# Altium project PCB_Project1.PrjPCB
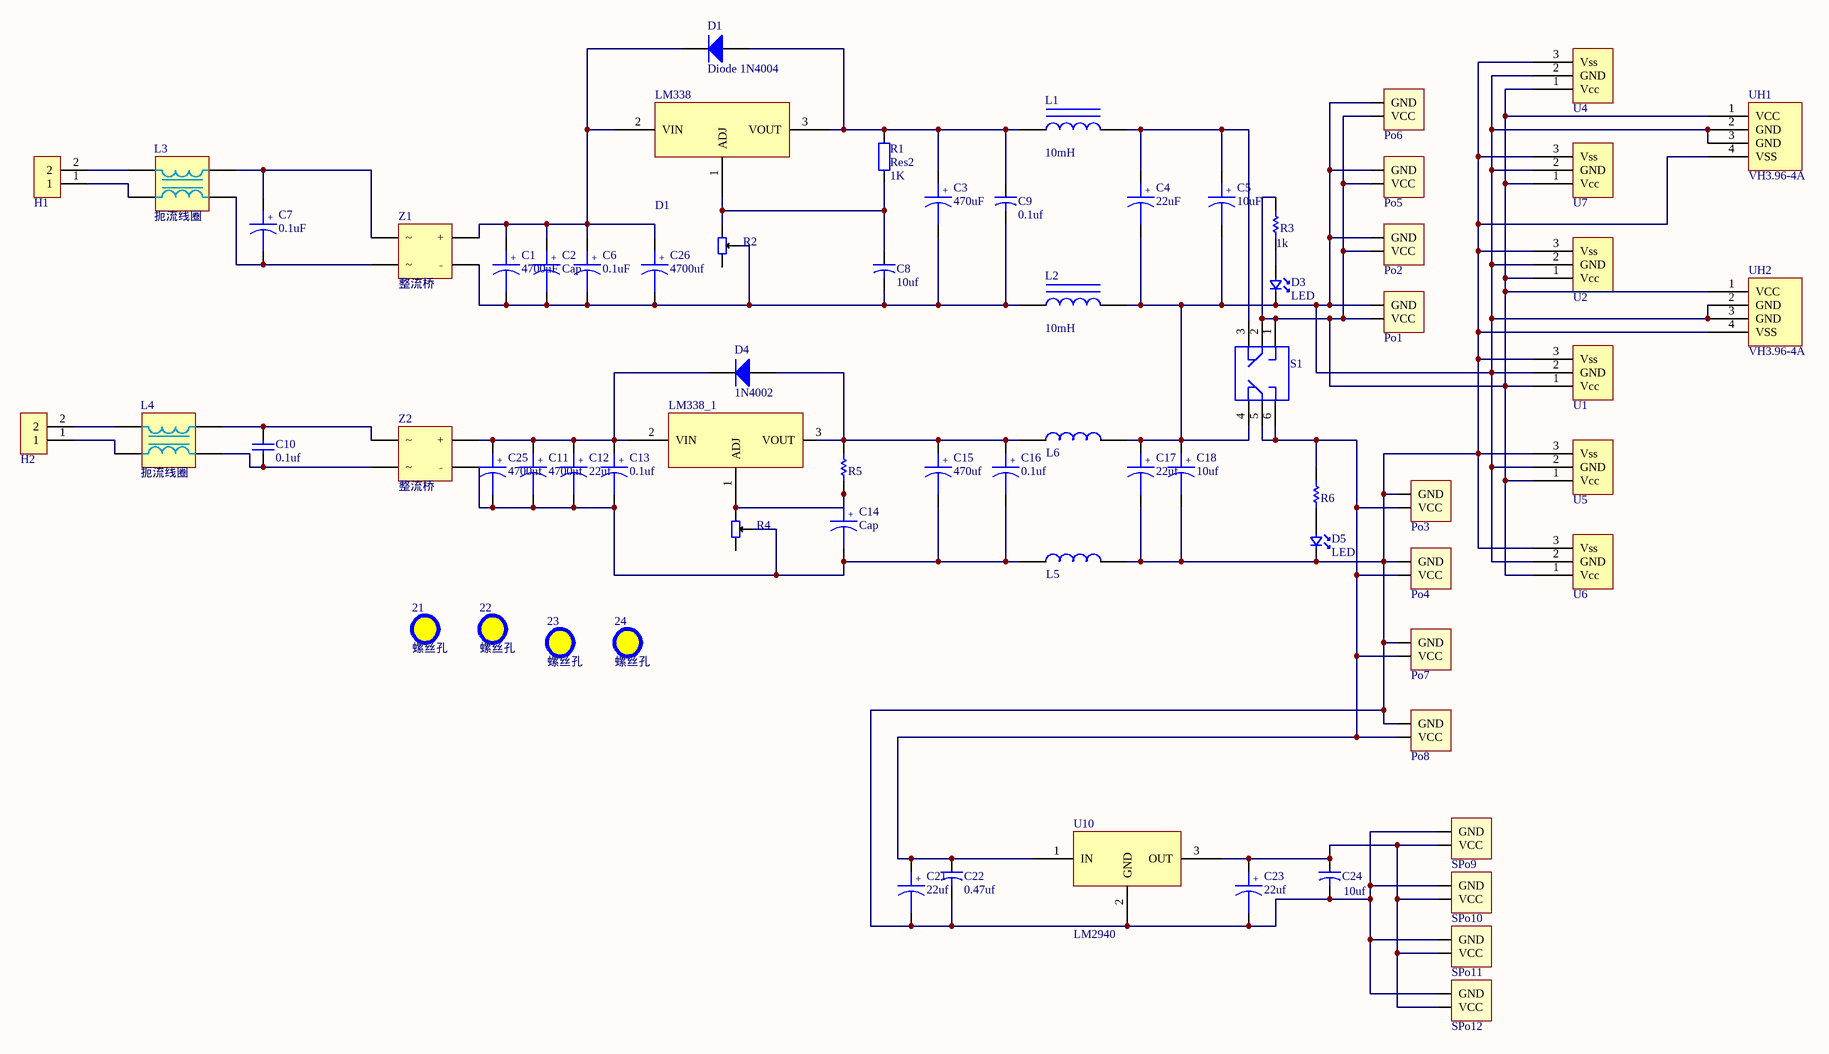
[diagram p0: 电源.SchDoc]
1 sheet, 72 parts. Net scope: global (net labels, ports and power ports of the same name join across sheets).
Board file: PCB3.PcbDoc

## Sheet 电源.SchDoc
size 381 x 381 mm

### Parts
21  螺丝孔  [固定过孔]
22  螺丝孔  [固定过孔]
23  螺丝孔  [固定过孔]
24  螺丝孔  [固定过孔]
C1  4700uF  [CD-7.6mm]
C2  Cap  [CD-2.2mm]
C3  470uF  [CD-5mm]
C4  22uF  [CD-2.2mm]
C5  10uF  [陶瓷电容]
C6  0.1uF  [独石电容]
C7  0.1uF  [安规电容]
C8  值: 10uf  [陶瓷电容]  (hidden comment: Cap)
C9  值: 0.1uf  [陶瓷电容]  (hidden comment: Cap)
C10  值: 0.1uf  [安规电容]  (hidden comment: Cap1)
C11  4700uf  [CD-7.6mm]
C12  22uf  [CD-2.2mm]
C13  0.1uf  [独石电容]
C14  Cap  [陶瓷电容]
C15  470uf  [CD-5mm]
C16  0.1uf  [陶瓷电容]
C17  22uf  [CD-2.2mm]
C18  10uf  [陶瓷电容]
C21  22uf  [CD-2.2mm]
C22  值: 0.47uf  [陶瓷电容]  (hidden comment: Cap)
C23  22uf  [CD-2.2mm]
C24  值: 10uf  [陶瓷电容]  (hidden comment: Cap)
C25  4700uf  [CD-7.6mm]
C26  4700uf  [CD-7.6mm]
D1  Diode 1N4004  [SMC]
D3  LED  [0805_s]
D4  1N4002  [SMC]
D5  LED  [0805_s]
H1  HT3.96-2P  [HT39.6-2P-S]  (value not drawn)
H2  HT3.96-2P  [HT39.6-2P-S]  (value not drawn)
L1  value 10mH  [功率电感-12x12 - duplicate]  (hidden comment: Inductor Iron)
L2  value 10mH  [功率电感-12x12 - duplicate]  (hidden comment: Inductor Iron)
L3  扼流线圈  [扼流线圈]
L4  扼流线圈  [扼流线圈]
L5  SMD  [功率电感-12x12 - duplicate]  (value not drawn)
L6  SMD  [功率电感-12x12 - duplicate]  (value not drawn)
LM338  D1  [LM338]
LM338_1  (no value)  [LM338]
Po1  Power_2Port  [Power_S_2Port]  (value not drawn)
Po2  Power_2Port  [Power_S_2Port]  (value not drawn)
Po3  Power_2Port  [Power_S_2Port]  (value not drawn)
Po4  Power_2Port  [Power_S_2Port]  (value not drawn)
Po5  Power_2Port  [Power_S_2Port]  (value not drawn)
Po6  Power_2Port  [Power_S_2Port]  (value not drawn)
Po7  Power_2Port  [Power_S_2Port]  (value not drawn)
Po8  Power_2Port  [Power_S_2Port]  (value not drawn)
R1  Res2  value 1K  [0805]
R2  可调电位器1  [电位器]  (value not drawn)
R3  1k  [0805]
R4  可调电位器1  [电位器]  (value not drawn)
R5  RES  [0805]  (value not drawn)
R6  RES  [0805]  (value not drawn)
S1  双掷开关  [SWITCH]  (value not drawn)
SPo9  Power_2Port  [Power_S_2Port]  (value not drawn)
SPo10  Power_2Port  [Power_S_2Port]  (value not drawn)
SPo11  Power_2Port  [Power_S_2Port]  (value not drawn)
SPo12  Power_2Port  [Power_S_2Port]  (value not drawn)
U1  XH2.54-3p  [XH2.54-3p]  (value not drawn)
U2  XH2.54-3p  [XH2.54-3p]  (value not drawn)
U4  XH2.54-3p  [XH2.54-3p]  (value not drawn)
U5  XH2.54-3p  [XH2.54-3p]  (value not drawn)
U6  XH2.54-3p  [XH2.54-3p]  (value not drawn)
U7  XH2.54-3p  [XH2.54-3p]  (value not drawn)
U10  LM2940  [TO-220]
UH1  VH3.96-4A  [VH3.96-4P]
UH2  VH3.96-4A  [VH3.96-4P]
Z1  整流桥  [整流桥]
Z2  整流桥  [整流桥]

### Nets
NetC1_1: C1.1 C2.1 C6.1 C26.1 D1.2(K) LM338.2(VIN) Z1.1(+)
NetC1_2: C1.2 C2.2 C3.2 C6.2 C8.2 C9.2 C26.2 L2.1 R2.2 Z1.4(﹣)
NetC3_1: C3.1 C9.1 D1.1(A) L1.1 LM338.3(VOUT) R1.2
NetC4_1: C4.1 C5.1 L1.2 S1.3
NetC4_2: C4.2 C5.2 C17.1 C18.1 D3.1 L2.2 L6.2 Po1.2(GND) Po2.2(GND) Po5.2(GND) Po6.2(GND) S1.4 U1.2(GND) U2.2(GND) U4.2(GND) U5.2(GND) U6.2(GND) U7.2(GND) UH1.2(GND) UH1.3(GND) UH2.2(GND) UH2.3(GND)
NetC7_1: C7.1 L3.2 Z1.2
NetC7_2: C7.2 L3.3 Z1.3
NetC8_1: C8.1 LM338.1(ADJ) R1.1 R2.3
NetC10_1: C10.1 L4.3 Z2.3
NetC10_2: C10.2 L4.2 Z2.2
NetC11_1: C11.1 C12.1 C13.1 C25.1 D4.2(K) LM338_1.2(VIN) Z2.1(+)
NetC11_2: C11.2 C12.2 C13.2 C14.2 C15.2 C16.2 C25.2 L5.1 R4.2 Z2.4(﹣)
NetC14_1: C14.1 LM338_1.1(ADJ) R4.3 R5.1
NetC15_1: C15.1 C16.1 D4.1(A) L6.1 LM338_1.3(VOUT) R5.2
NetC17_2: C17.2 C18.2 C21.2 C22.2 C23.2 C24.2 D5.1 L5.2 Po3.2(GND) Po4.2(GND) Po7.2(GND) Po8.2(GND) SPo9.2(GND) SPo10.2(GND) SPo11.2(GND) SPo12.2(GND) U1.3(Vss) U2.3(Vss) U4.3(Vss) U5.3(Vss) U6.3(Vss) U7.3(Vss) U10.2(GND) UH1.4(VSS) UH2.4(VSS)
NetC21_1: C21.1 C22.1 Po3.1(VCC) Po4.1(VCC) Po7.1(VCC) Po8.1(VCC) R6.2 S1.5 S1.6 U10.1(IN)
NetC23_1: C23.1 C24.1 SPo9.1(VCC) SPo10.1(VCC) SPo11.1(VCC) SPo12.1(VCC) U10.3(OUT)
NetD3_2: D3.2 R3.1
NetD5_2: D5.2 R6.1
NetH1_1: H1.1 L3.4
NetH1_2: H1.2 L3.1
NetH2_1: H2.1 L4.4
NetH2_2: H2.2 L4.1
NetPo1_1: Po1.1(VCC) Po2.1(VCC) Po5.1(VCC) Po6.1(VCC) R3.2 S1.1 S1.2 U1.1(Vcc) U2.1(Vcc) U4.1(Vcc) U5.1(Vcc) U6.1(Vcc) U7.1(Vcc) UH1.1(VCC) UH2.1(VCC)

Not connected (* = marked no-connect by the designer): R2 1; R4 1

### Notes on the sheet
- (in symbol Cap) +

### Library data of the parts
C1 C3-C7 C11-C13 C15-C18 C21 C23 C25 C26 = Cap
C8 C9 C22 C24 = Cap_1
D1 = Diode 1N4004: 1 Amp General Purpose Rectifier; Published: 8-Jun-2000; LatestRevisionDate: 17-Jul-2002; LatestRevisionNote: Re-released for DXP Platform.; DatasheetVersion: 1998; PackageVersion: Aug-1999; PackageReference: DO-41; Publisher: Altium Limited; PackageDescription: Diode, Axial; Body 5.2 x 2.7 mm (LxDia. max), Lead Dia. 0.86 mm (max); Code_JEDEC: DO-204-AL; ComponentLink1Description: Manufacturer Link; ComponentLink1URL: http://www.fairchildsemi.com/; ComponentLink2Description: Datasheet; ComponentLink2URL: http://www.fairchildsemi.com/ds/1N%2F1N4001.pdf
D4 = Diode: Default Diode; Published: 8-Jun-2000; LatestRevisionDate: 17-Jul-2002; LatestRevisionNote: Re-released for DXP Platform.; PackageVersion: Sep-1996; PackageReference: SMC; Publisher: Altium Limited; PackageDescription: DO-214-AB/SMC; 2 C-Bend Leads; Body 7.9 x 5.9 mm, inc. leads (LxW); Code_JEDEC: DO-214-AB
L1 L2 = Inductor Iron: Magnetic-Core Inductor; Published: 24-Mar-1999; LatestRevisionDate: 17-Jul-2002; LatestRevisionNote: Re-released for DXP Platform.; PackageReference: AXIAL-0.9; Publisher: Altium Limited; PackageDescription: Axial Device, Thru-Hole; 2 Leads; 0.9 in Pin Spacing
L5 L6 = 功率电感
LM338 LM338_1 = LM338
R1 = Res2: Resistor; Published: 8-Jun-2000; LatestRevisionDate: 17-Jul-2002; LatestRevisionNote: Re-released for DXP Platform.; PackageReference: AXIAL-0.4; Publisher: Altium Limited; PackageDescription: Axial Device, Thru-Hole; 2 Leads; 0.4 in Pin Spacing
R3 = RES: 值: 1k
R5 R6 = RES: 值: 1k